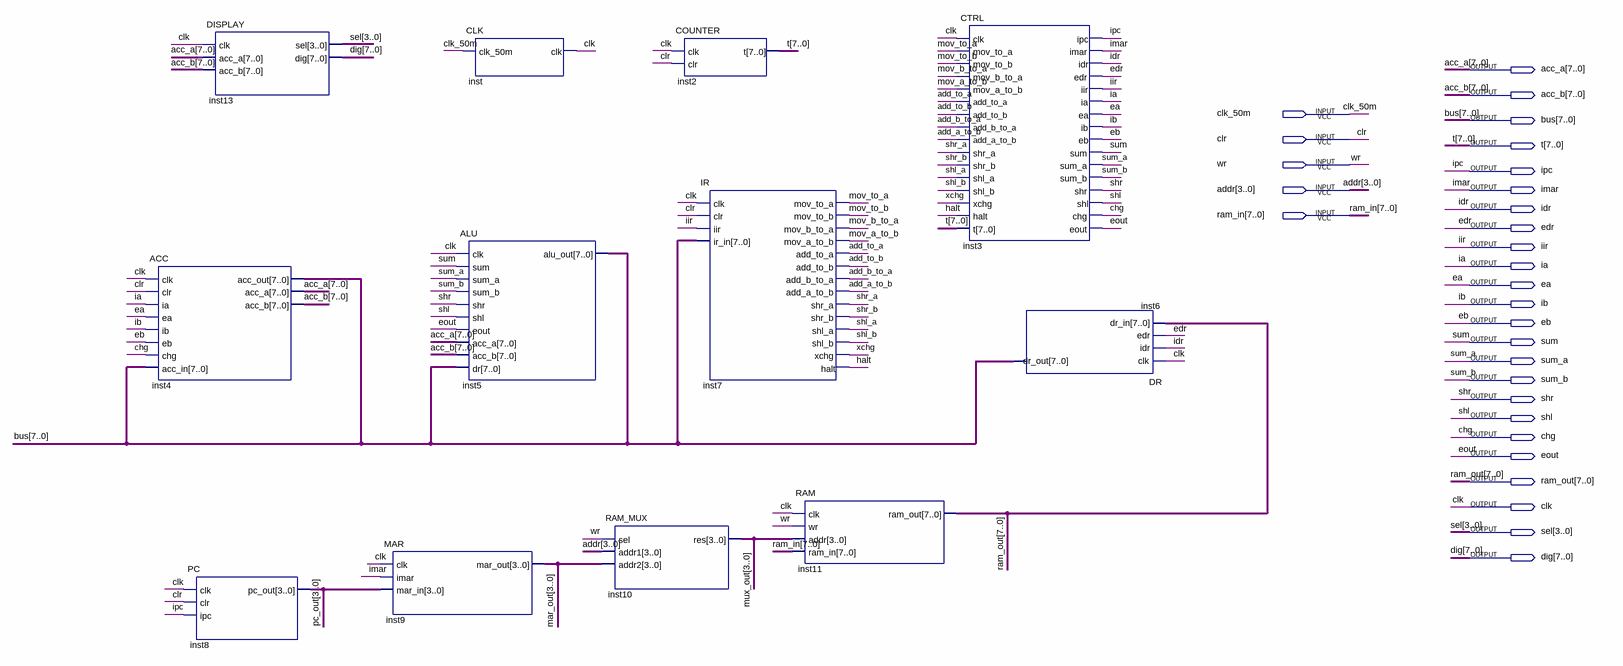
[diagram p0: schematic sheet]
// Quartus schematic COMPUTER_TEST.bdf as structural Verilog: 12 symbols, 29 pins
module COMPUTER_TEST (
  input  clk_50m,
  input  clr,
  input  wr,
  input  [3:0] addr,
  input  [7:0] ram_in,
  output [7:0] acc_a,
  output [7:0] acc_b,
  output [7:0] bus,
  output [7:0] t,
  output ipc,
  output imar,
  output idr,
  output edr,
  output iir,
  output ia,
  output ea,
  output ib,
  output eb,
  output sum,
  output sum_a,
  output sum_b,
  output shr,
  output shl,
  output chg,
  output eout,
  output [7:0] ram_out,
  output clk,
  output [3:0] sel,
  output [7:0] dig
);

  wire add_a_to_b, add_b_to_a, add_to_a, add_to_b, halt, mov_a_to_b, mov_b_to_a, mov_to_a, mov_to_b, shl_a,
       shl_b, shr_a, shr_b, xchg;
  wire [3:0] mar_out, mux_out, pc_out;

  ACC inst4 (
    .clk(clk), .clr(clr), .ia(ia), .ea(ea), .ib(ib), .eb(eb), .chg(chg), .acc_in(bus), .acc_out(bus),
    .acc_a(acc_a), .acc_b(acc_b));
  PC inst8 (.clk(clk), .clr(clr), .ipc(ipc), .pc_out(pc_out));
  DISPLAY inst13 (.clk(clk), .acc_a(acc_a), .acc_b(acc_b), .sel(sel), .dig(dig));
  MAR inst9 (.clk(clk), .imar(imar), .mar_in(pc_out), .mar_out(mar_out));
  CLK inst (.clk_50m(clk_50m), .clk(clk));
  ALU inst5 (
    .clk(clk), .sum(sum), .sum_a(sum_a), .sum_b(sum_b), .shr(shr), .shl(shl), .eout(eout), .acc_a(acc_a),
    .acc_b(acc_b), .dr(bus), .alu_out(bus));
  RAM_MUX inst10 (.sel(wr), .addr1(addr), .addr2(mar_out), .res(mux_out));
  COUNTER inst2 (.clk(clk), .clr(clr), .t(t));
  IR inst7 (
    .clk(clk), .clr(clr), .iir(iir), .ir_in(bus), .mov_to_a(mov_to_a), .mov_to_b(mov_to_b),
    .mov_b_to_a(mov_b_to_a), .mov_a_to_b(mov_a_to_b), .add_to_a(add_to_a), .add_to_b(add_to_b),
    .add_b_to_a(add_b_to_a), .add_a_to_b(add_a_to_b), .shr_a(shr_a), .shr_b(shr_b), .shl_a(shl_a),
    .shl_b(shl_b), .xchg(xchg), .halt(halt));
  RAM inst11 (.clk(clk), .wr(wr), .addr(mux_out), .ram_in(ram_in), .ram_out(ram_out));
  CTRL inst3 (
    .clk(clk), .mov_to_a(mov_to_a), .mov_to_b(mov_to_b), .mov_b_to_a(mov_b_to_a), .mov_a_to_b(mov_a_to_b),
    .add_to_a(add_to_a), .add_to_b(add_to_b), .add_b_to_a(add_b_to_a), .add_a_to_b(add_a_to_b),
    .shr_a(shr_a), .shr_b(shr_b), .shl_a(shl_a), .shl_b(shl_b), .xchg(xchg), .halt(halt), .t(t), .ipc(ipc),
    .imar(imar), .idr(idr), .edr(edr), .iir(iir), .ia(ia), .ea(ea), .ib(ib), .eb(eb), .sum(sum),
    .sum_a(sum_a), .sum_b(sum_b), .shr(shr), .shl(shl), .chg(chg), .eout(eout));
  DR inst6 (.clk(clk), .idr(idr), .edr(edr), .dr_in(ram_out), .dr_out(bus));
endmodule
